# Altium project main_controller.PrjPcb
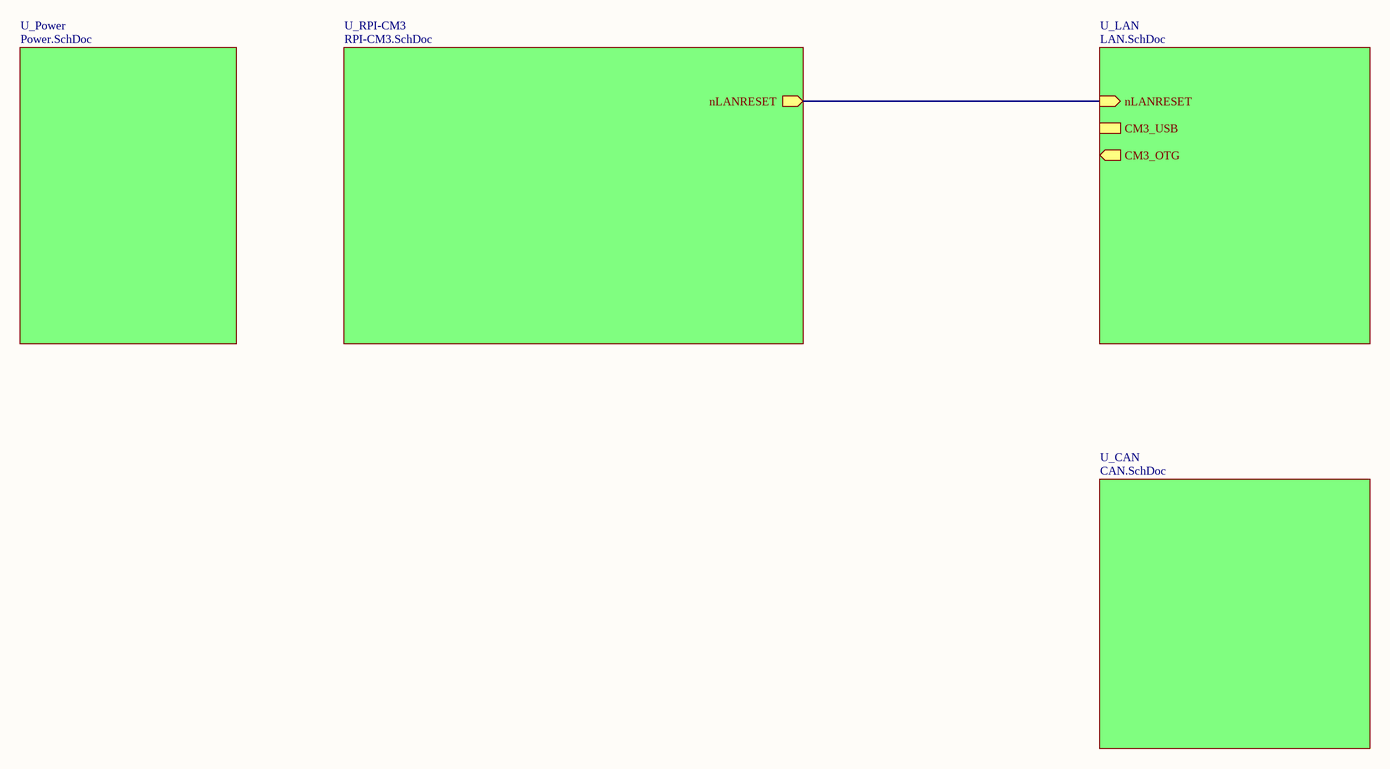
[diagram p0: TOP.SchDoc]
6 sheets, 243 parts. Net scope: hierarchical (ports join the sheet entries above them; power ports are global).
Sheets:
  TOP.SchDoc
    U_Power = Power.SchDoc
    U_RPI-CM3 = RPI-CM3.SchDoc
    U_LAN = LAN.SchDoc
      U_LAN-PWR = LAN-PWR.SchDoc
    U_CAN = CAN.SchDoc

## Sheet TOP.SchDoc
size A2

### Sub-sheets
U_CAN = CAN.SchDoc: no entries
U_LAN = LAN.SchDoc: nLANRESET (in), CM3_OTG (out), CM3_USB (harness CM3_USB)
U_Power = Power.SchDoc: no entries
U_RPI-CM3 = RPI-CM3.SchDoc: nLANRESET (out)

### Nets
NetA?#1_3: sheet U_RPI-CM3/nLANRESET, sheet U_LAN/nLANRESET

### Notes on the sheet
- Title
- Size:
- Date:
- A3
- Number:
- Time:
- Revision:
- Sheet
- of
- File:

## Sheet Power.SchDoc
size A2
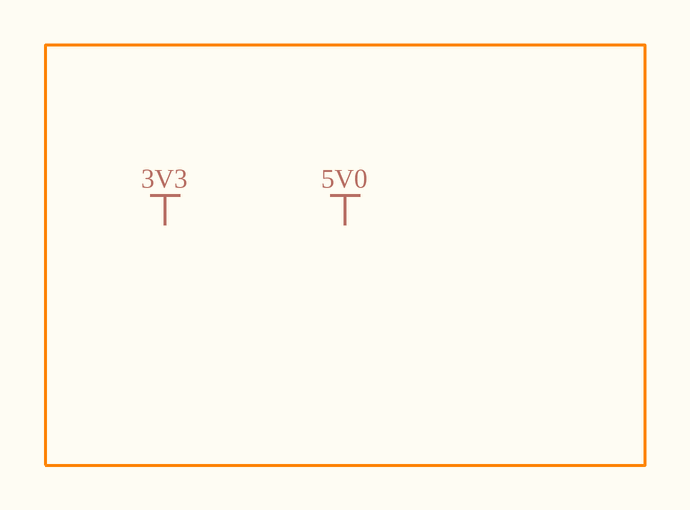
[diagram p1: Power.SchDoc]

### Notes on the sheet
- Labels drawn without touching a wire or pin: 3V3, 5V0
- Title
- Size:
- Date:
- A3
- Number:
- Time:
- Revision:
- Sheet
- of
- File:

## Sheet RPI-CM3.SchDoc
size A2
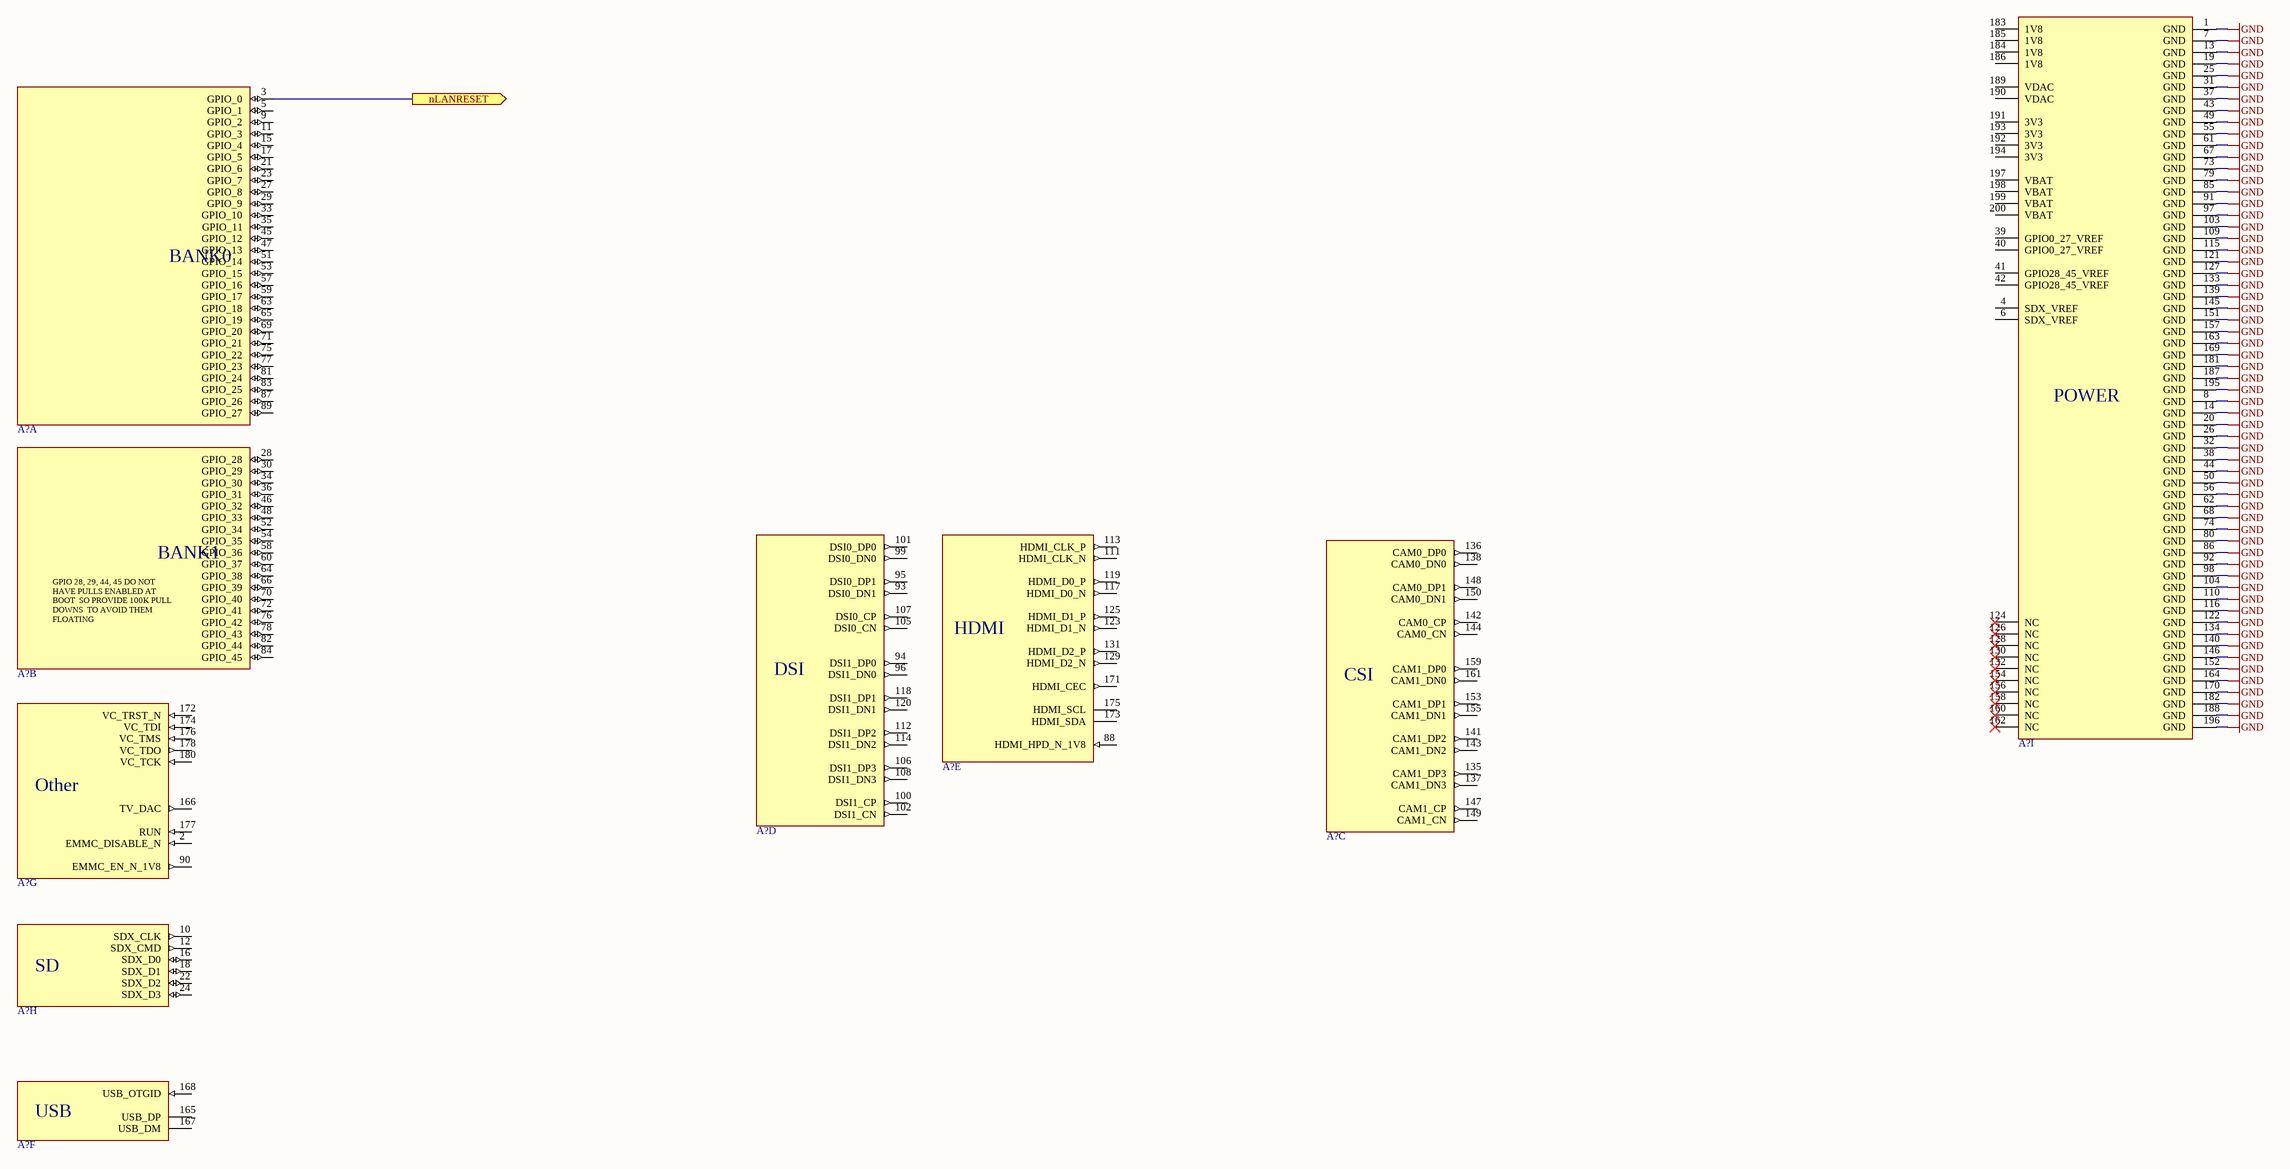
[diagram p2: RPI-CM3.SchDoc]

### Parts
(Parts that share a designator on the sheet are numbered #1, #2 ... from top to bottom, then left to right.)
A?#1  RPi-CM3  [SODIMM_TE_1717254-4_RPi_CM]  (value not drawn)  (part A of 9)
A?#2  RPi-CM3  [SODIMM_TE_1717254-4_RPi_CM]  (value not drawn)  (part B of 9)
A?#3  RPi-CM3  [SODIMM_TE_1717254-4_RPi_CM]  (value not drawn)  (part I of 9)
A?#4  RPi-CM3  [SODIMM_TE_1717254-4_RPi_CM]  (value not drawn)  (part E of 9)
A?#5  RPi-CM3  [SODIMM_TE_1717254-4_RPi_CM]  (value not drawn)  (part D of 9)
A?#6  RPi-CM3  [SODIMM_TE_1717254-4_RPi_CM]  (value not drawn)  (part C of 9)
A?#7  RPi-CM3  [SODIMM_TE_1717254-4_RPi_CM]  (value not drawn)  (part G of 9)
A?#8  RPi-CM3  [SODIMM_TE_1717254-4_RPi_CM]  (value not drawn)  (part H of 9)
A?#9  RPi-CM3  [SODIMM_TE_1717254-4_RPi_CM]  (value not drawn)  (part F of 9)

### Ports
nLANRESET (out)

### Nets
GND: A?#3.1(GND) A?#3.7(GND) A?#3.8(GND) A?#3.13(GND) A?#3.14(GND) A?#3.19(GND) A?#3.20(GND) A?#3.25(GND) A?#3.26(GND) A?#3.31(GND) A?#3.32(GND) A?#3.37(GND) A?#3.38(GND) A?#3.43(GND) A?#3.44(GND) A?#3.49(GND) A?#3.50(GND) A?#3.55(GND) A?#3.56(GND) A?#3.61(GND) A?#3.62(GND) A?#3.67(GND) A?#3.68(GND) A?#3.73(GND) A?#3.74(GND) A?#3.79(GND) A?#3.80(GND) A?#3.85(GND) A?#3.86(GND) A?#3.91(GND) A?#3.92(GND) A?#3.97(GND) A?#3.98(GND) A?#3.103(GND) A?#3.104(GND) A?#3.109(GND) A?#3.110(GND) A?#3.115(GND) A?#3.116(GND) A?#3.121(GND) A?#3.122(GND) A?#3.127(GND) A?#3.133(GND) A?#3.134(GND) A?#3.139(GND) A?#3.140(GND) A?#3.145(GND) A?#3.146(GND) A?#3.151(GND) A?#3.152(GND) A?#3.157(GND) A?#3.163(GND) A?#3.164(GND) A?#3.169(GND) A?#3.170(GND) A?#3.181(GND) A?#3.182(GND) A?#3.187(GND) A?#3.188(GND) A?#3.195(GND) A?#3.196(GND)
NetA?#1_3: A?#1.3(GPIO_0) ; port nLANRESET

Not connected (* = marked no-connect by the designer): A?#1 5(GPIO_1) 9(GPIO_2) 11(GPIO_3) 15(GPIO_4) 17(GPIO_5) 21(GPIO_6) 23(GPIO_7) 27(GPIO_8) 29(GPIO_9) 33(GPIO_10) 35(GPIO_11) 45(GPIO_12) 47(GPIO_13) 51(GPIO_14) 53(GPIO_15) 57(GPIO_16) 59(GPIO_17) 63(GPIO_18) 65(GPIO_19) 69(GPIO_20) 71(GPIO_21) 75(GPIO_22) 77(GPIO_23) 81(GPIO_24) 83(GPIO_25) 87(GPIO_26) 89(GPIO_27); A?#2 28(GPIO_28) 30(GPIO_29) 34(GPIO_30) 36(GPIO_31) 46(GPIO_32) 48(GPIO_33) 52(GPIO_34) 54(GPIO_35) 58(GPIO_36) 60(GPIO_37) 64(GPIO_38) 66(GPIO_39) 70(GPIO_40) 72(GPIO_41) 76(GPIO_42) 78(GPIO_43) 82(GPIO_44) 84(GPIO_45); A?#3 4(SDX_VREF) 6(SDX_VREF) 39(GPIO0_27_VREF) 40(GPIO0_27_VREF) 41(GPIO28_45_VREF) 42(GPIO28_45_VREF) 124(NC)* 126(NC)* 128(NC)* 130(NC)* 132(NC)* 154(NC)* 156(NC)* 158(NC)* 160(NC)* 162(NC)* 183(1V8) 184(1V8) 185(1V8) 186(1V8) 189(VDAC) 190(VDAC) 191(3V3) 192(3V3) 193(3V3) 194(3V3) 197(VBAT) 198(VBAT) 199(VBAT) 200(VBAT); A?#4 88(HDMI_HPD_N_1V8) 111(HDMI_CLK_N) 113(HDMI_CLK_P) 117(HDMI_D0_N) 119(HDMI_D0_P) 123(HDMI_D1_N) 125(HDMI_D1_P) 129(HDMI_D2_N) 131(HDMI_D2_P) 171(HDMI_CEC) 173(HDMI_SDA) 175(HDMI_SCL); A?#5 93(DSI0_DN1) 94(DSI1_DP0) 95(DSI0_DP1) 96(DSI1_DN0) 99(DSI0_DN0) 100(DSI1_CP) 101(DSI0_DP0) 102(DSI1_CN) 105(DSI0_CN) 106(DSI1_DP3) 107(DSI0_CP) 108(DSI1_DN3) 112(DSI1_DP2) 114(DSI1_DN2) 118(DSI1_DP1) 120(DSI1_DN1); A?#6 135(CAM1_DP3) 136(CAM0_DP0) 137(CAM1_DN3) 138(CAM0_DN0) 141(CAM1_DP2) 142(CAM0_CP) 143(CAM1_DN2) 144(CAM0_CN) 147(CAM1_CP) 148(CAM0_DP1) 149(CAM1_CN) 150(CAM0_DN1) 153(CAM1_DP1) 155(CAM1_DN1) 159(CAM1_DP0) 161(CAM1_DN0); A?#7 2(EMMC_DISABLE_N) 90(EMMC_EN_N_1V8) 166(TV_DAC) 172(VC_TRST_N) 174(VC_TDI) 176(VC_TMS) 177(RUN) 178(VC_TDO) 180(VC_TCK); A?#8 10(SDX_CLK) 12(SDX_CMD) 16(SDX_D0) 18(SDX_D1) 22(SDX_D2) 24(SDX_D3); A?#9 165(USB_DP) 167(USB_DM) 168(USB_OTGID)

### Notes on the sheet
- Title
- Size:
- Date:
- A3
- Number:
- Time:
- Revision:
- Sheet
- of
- File:
- (in symbol 040107-0001, part A) BANK0
- (in symbol 040107-0001, part B) BANK1; GPIO 28, 29, 44, 45 DO NOT  HAVE PULLS ENABLED AT BOOT  SO PROVIDE 100K PULL DOWNS  TO AVOID THEM FLOATING
- (in symbol 040107-0001, part C) CSI
- (in symbol 040107-0001, part D) DSI
- (in symbol 040107-0001, part E) HDMI
- (in symbol 040107-0001, part F) USB
- (in symbol 040107-0001, part G) Other
- (in symbol 040107-0001, part H) SD
- (in symbol 040107-0001, part I) POWER

### Library data of the parts
A?#1-A?#9 = 040107-0001: I# SOM RaspberryPi Compute Module 3 RPi-CM3; TempRange: -25/80°C; PartNumber: 040107-0001; Value: RPi-CM3; Info: RaspberryPi Compute Module 3

## Sheet LAN.SchDoc
size A2
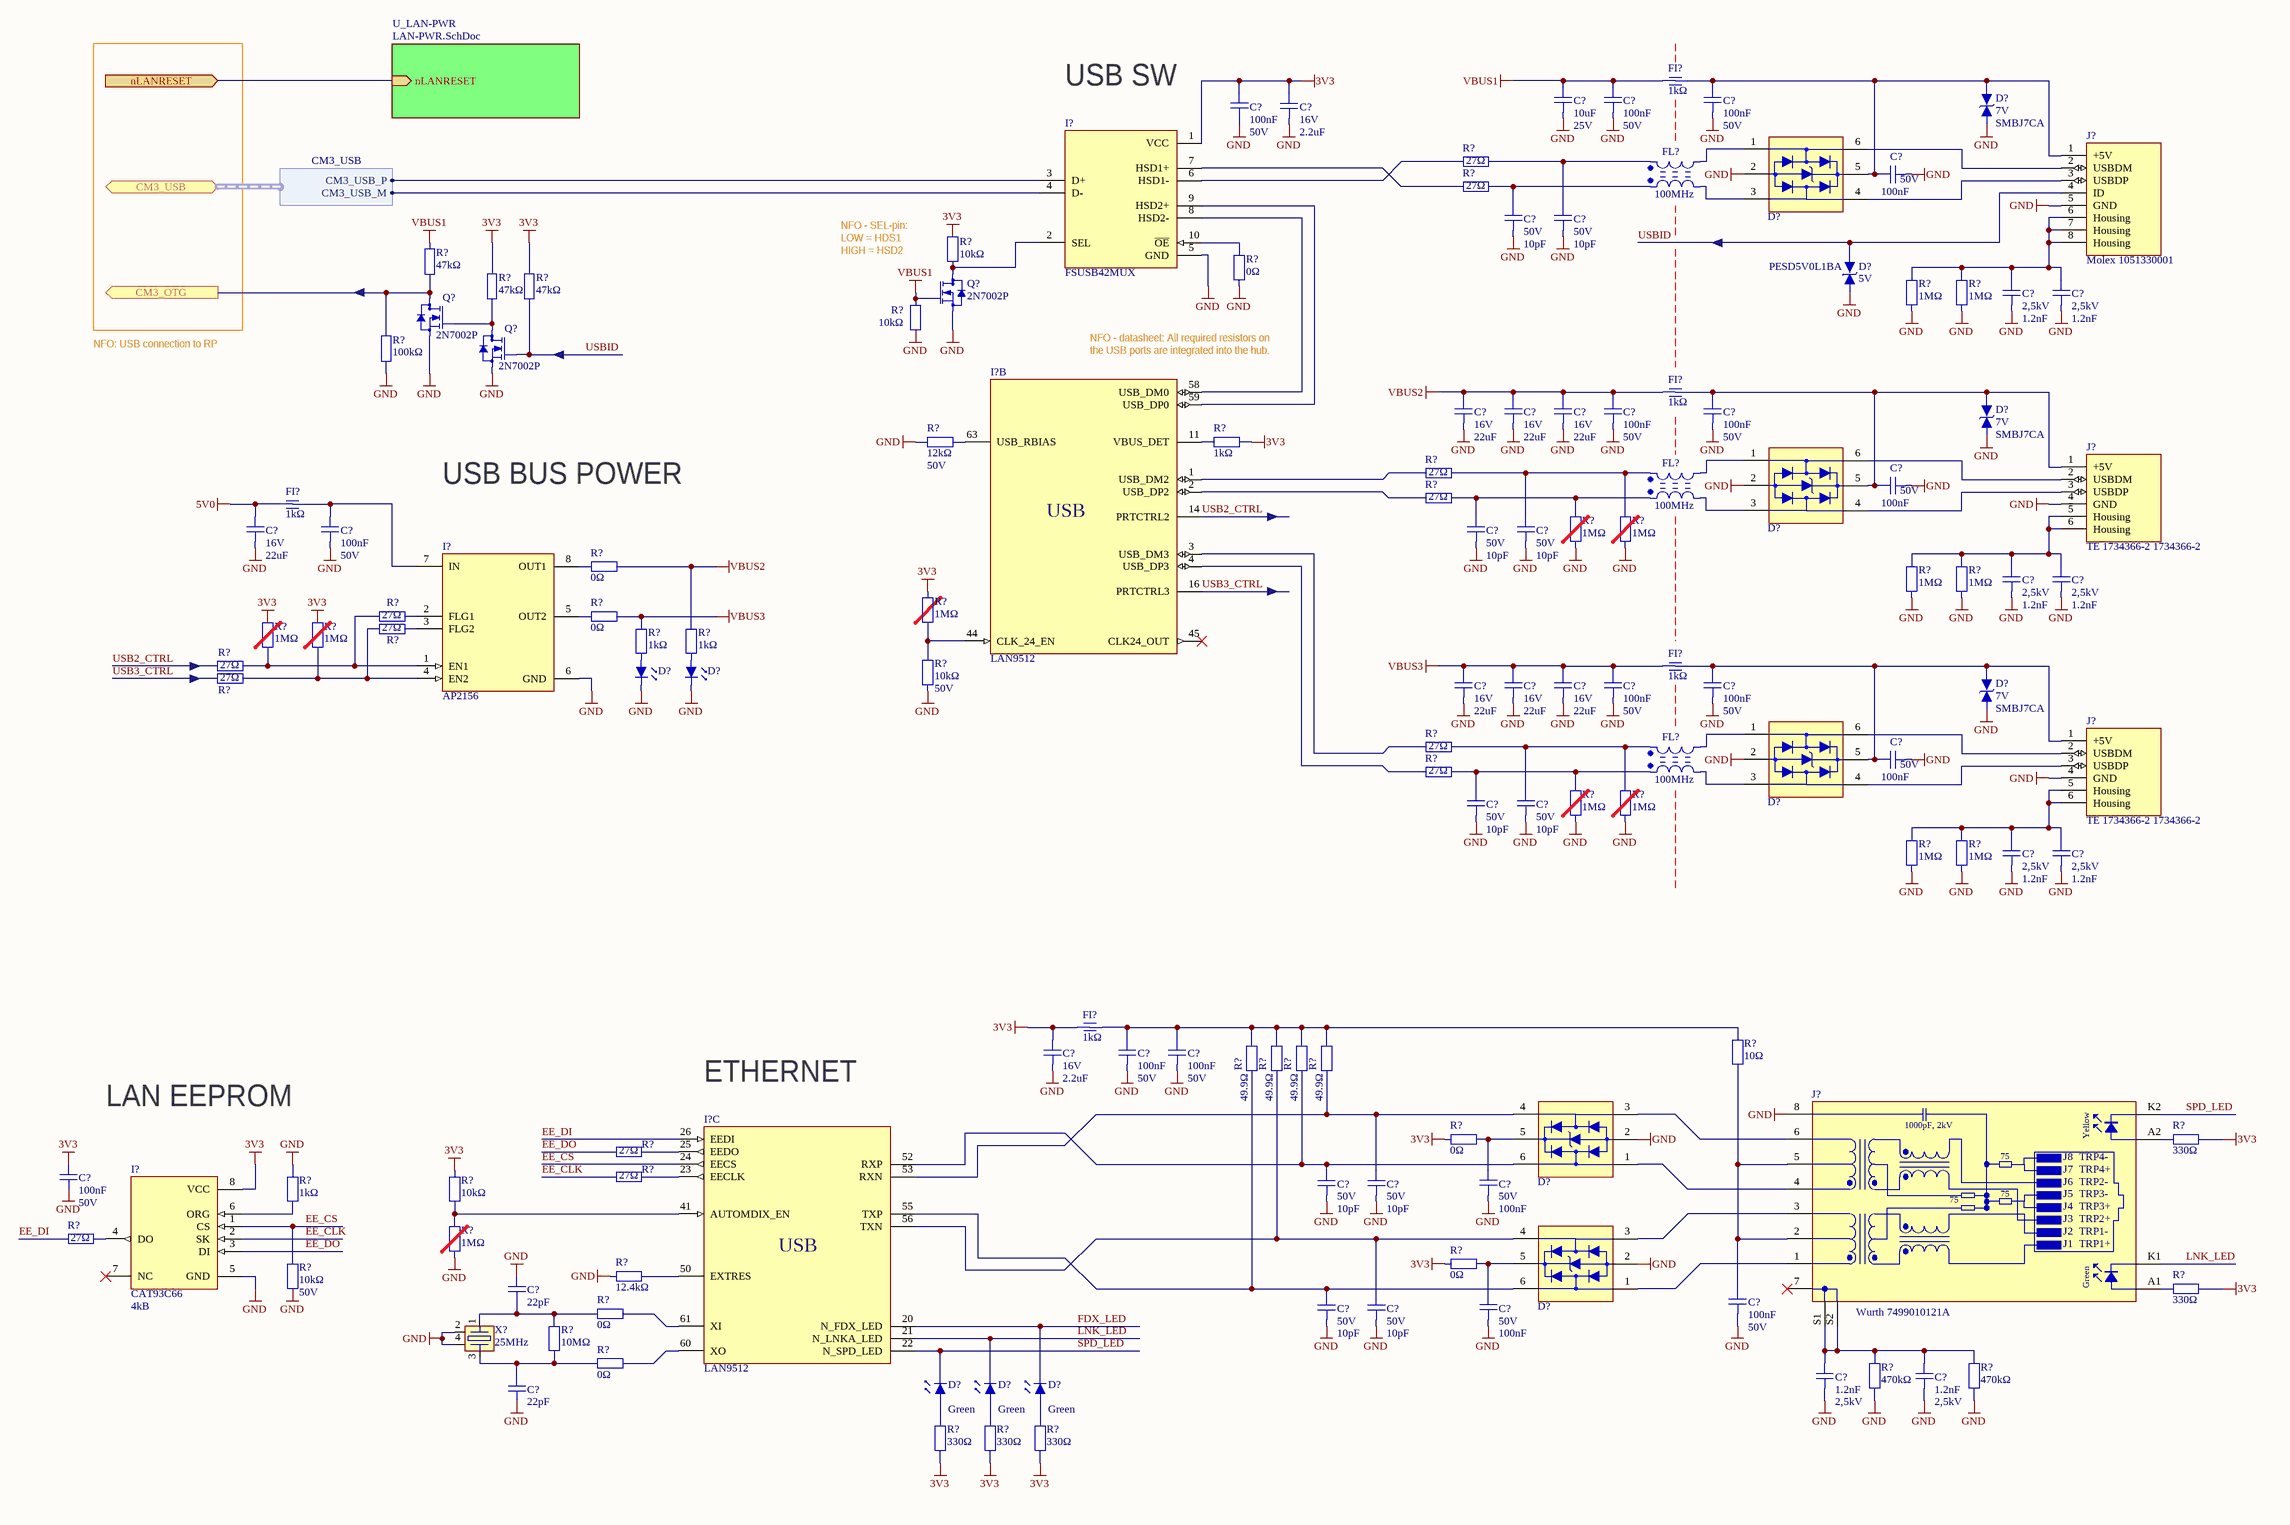
[diagram p3: LAN.SchDoc]

### Parts
(Parts that share a designator on the sheet are numbered #1, #2 ... from top to bottom, then left to right.)
C?#1  Voltage: 25V  [C0603M_1709282117]  (hidden comment: 10uF)
C?#2  Voltage: 50V  [C0603M_1709282117]  (hidden comment: 100nF)
C?#3  Voltage: 50V  [C0603M_1709282117]  (hidden comment: 100nF)
C?#4  Voltage: 50V  [C0603M_1709282117]  (hidden comment: 100nF)
C?#5  Value2: 16V  [C0603M_1709282117]  (hidden comment: 2.2uF)
C?#6  Value2: 50V  [C0402M_CAPC1005X06N]  (hidden comment: 100nF)
C?#7  Value2: 50V  [C0603M_1709282117]  (hidden comment: 10pF)
C?#8  Value2: 50V  [C0603M_1709282117]  (hidden comment: 10pF)
C?#9  Value2: 2,5kV  [C1808M_1709112222]  (hidden comment: 1.2nF)
C?#10  Value2: 2,5kV  [C1808M_1709112222]  (hidden comment: 1.2nF)
C?#11  Value2: 16V  [C0805M_1708282121]  (hidden comment: 22uF)
C?#12  Value2: 16V  [C0805M_1708282121]  (hidden comment: 22uF)
C?#13  Value2: 16V  [C0805M_1708282121]  (hidden comment: 22uF)
C?#14  Voltage: 50V  [C0603M_1709282117]  (hidden comment: 100nF)
C?#15  Voltage: 50V  [C0603M_1709282117]  (hidden comment: 100nF)
C?#16  Value2: 50V  [C0402M_CAPC1005X06N]  (hidden comment: 100nF)
C?#17  Value2: 16V  [C0805M_1708282121]  (hidden comment: 22uF)
C?#18  Voltage: 50V  [C0603M_1709282117]  (hidden comment: 100nF)
C?#19  Value2: 50V  [C0603M_1709282117]  (hidden comment: 10pF)
C?#20  Value2: 50V  [C0603M_1709282117]  (hidden comment: 10pF)
C?#21  Value2: 2,5kV  [C1808M_1709112222]  (hidden comment: 1.2nF)
C?#22  Value2: 2,5kV  [C1808M_1709112222]  (hidden comment: 1.2nF)
C?#23  Value2: 16V  [C0805M_1708282121]  (hidden comment: 22uF)
C?#24  Value2: 16V  [C0805M_1708282121]  (hidden comment: 22uF)
C?#25  Value2: 16V  [C0805M_1708282121]  (hidden comment: 22uF)
C?#26  Voltage: 50V  [C0603M_1709282117]  (hidden comment: 100nF)
C?#27  Voltage: 50V  [C0603M_1709282117]  (hidden comment: 100nF)
C?#28  Value2: 50V  [C0402M_CAPC1005X06N]  (hidden comment: 100nF)
C?#29  Value2: 50V  [C0603M_1709282117]  (hidden comment: 10pF)
C?#30  Value2: 50V  [C0603M_1709282117]  (hidden comment: 10pF)
C?#31  Value2: 2,5kV  [C1808M_1709112222]  (hidden comment: 1.2nF)
C?#32  Value2: 2,5kV  [C1808M_1709112222]  (hidden comment: 1.2nF)
C?#33  Value2: 16V  [C0603M_1709282117]  (hidden comment: 2.2uF)
C?#34  Voltage: 50V  [C0603M_1709282117]  (hidden comment: 100nF)
C?#35  Voltage: 50V  [C0603M_1709282117]  (hidden comment: 100nF)
C?#36  Voltage: 50V  [C0603M_1709282117]  (hidden comment: 100nF)
C?#37  Value2: 50V  [C0603M_1709282117]  (hidden comment: 10pF)
C?#38  Value2: 50V  [C0603M_1709282117]  (hidden comment: 10pF)
C?#39  Value2: 50V  [C0402M_CAPC1005X06N]  (hidden comment: 100nF)
C?#40  22pF  [C0603M_1709282117]
C?#41  Voltage: 50V  [C0603M_1709282117]  (hidden comment: 100nF)
C?#42  Value2: 50V  [C0603M_1709282117]  (hidden comment: 10pF)
C?#43  Value2: 50V  [C0603M_1709282117]  (hidden comment: 10pF)
C?#44  Value2: 50V  [C0402M_CAPC1005X06N]  (hidden comment: 100nF)
C?#45  Voltage: 2,5kV  [C1808M_1709112222]  (hidden comment: 1.2nF)
C?#46  Voltage: 2,5kV  [C1808M_1709112222]  (hidden comment: 1.2nF)
C?#47  22pF  [C0603M_1709282117]
D?#1  Value2: SMBJ7CA  [SMB_1709102243]  (hidden comment: 7V)
D?#2  USBLC6-2  [SOT23-6_1709062233]  (value not drawn)
D?#3  Value2: PESD5V0L1BA  [SOD-323_1706282215]  (hidden comment: 5V)
D?#4  Value2: SMBJ7CA  [SMB_1709102243]  (hidden comment: 7V)
D?#5  USBLC6-2  [SOT23-6_1709062233]  (value not drawn)
D?#6  SML-D12P8WT86C  [LED_SML-D12x8_1709122228]  (value not drawn)
D?#7  SML-D12P8WT86C  [LED_SML-D12x8_1709122228]  (value not drawn)
D?#8  Value2: SMBJ7CA  [SMB_1709102243]  (hidden comment: 7V)
D?#9  USBLC6-2  [SOT23-6_1709062233]  (value not drawn)
D?#10  USBLC6-2  [SOT23-6_1709062233]  (value not drawn)
D?#11  USBLC6-2  [SOT23-6_1709062233]  (value not drawn)
D?#12  Color: Green  [LED_SML-D12x8_1709122228]  (hidden comment: SML-D12P8WT86C)
D?#13  Color: Green  [LED_SML-D12x8_1709122228]  (hidden comment: SML-D12P8WT86C)
D?#14  Color: Green  [LED_SML-D12x8_1709122228]  (hidden comment: SML-D12P8WT86C)
FI?#1  1kΩ  [L0805M_1708232324]
FI?#2  1kΩ  [L0805M_1708232324]
FI?#3  1kΩ  [L0805M_1708232324]
FI?#4  1kΩ  [L0805M_1708232324]
FI?#5  1kΩ  [L0805M_1708232324]
FL?#1  Value2: 100MHz  [CM0805M_1709062254]  (hidden comment: 90Ω)
FL?#2  Value2: 100MHz  [CM0805M_1709062254]  (hidden comment: 90Ω)
FL?#3  Value2: 100MHz  [CM0805M_1709062254]  (hidden comment: 90Ω)
I?#1  FSUSB42MUX  [MSOP10_1709052053]
I?#2  LAN9512  [QFN64_1706282152]  (part B of 3)
I?#3  AP2156  [MSOP8_EP_1709052156]
I?#4  Size: 4kB  [TSSOP8_1709172348]  (hidden comment: CAT93C66)
I?#5  LAN9512  [QFN64_1706282152]  (part C of 3)
J?#1  Article: Molex 1051330001  [USB_A_MOLEX_1051330001_1709052340]
J?#2  Article: TE 1734366-2 / 1734366-2  [USB_A_TE_1734366-2_1709052230]
J?#3  Article: TE 1734366-2 / 1734366-2  [USB_A_TE_1734366-2_1709052230]
J?#4  Article: Wurth 7499010121A  [RJ45_WE_7499010121A]
Q?#1  2N7002P  [SOT23_1709070018]
Q?#2  2N7002P  [SOT23_1709070018]
Q?#3  2N7002P  [SOT23_1709070018]
R?#1  27Ω  [R0603M_RESC1608X06N]
R?#2  27Ω  [R0603M_RESC1608X06N]
R?#3  10kΩ  [R0603M_RESC1608X06N]
R?#4  47kΩ  [R0603M_RESC1608X06N]
R?#5  0Ω  [R0603M_RESC1608X06N]
R?#6  47kΩ  [R0603M_RESC1608X06N]
R?#7  47kΩ  [R0603M_RESC1608X06N]
R?#8  1MΩ  [R0603M_RESC1608X06N]
R?#9  1MΩ  [R0603M_RESC1608X06N]
R?#10  10kΩ  [R0603M_RESC1608X06N]
R?#11  100kΩ  [R0603M_RESC1608X06N]
R?#12  Voltage: 50V  [R0603M_RESC1608X06N]  (hidden comment: 12kΩ)
R?#13  1kΩ  [R0603M_RESC1608X06N]
R?#14  27Ω  [R0603M_RESC1608X06N]
R?#15  27Ω  [R0603M_RESC1608X06N]
R?#16  1MΩ  [R0603M_RESC1608X06N]
R?#17  1MΩ  [R0603M_RESC1608X06N]
R?#18  0Ω  [R0805M_RESC2012X06N]
R?#19  1MΩ  [R0603M_RESC1608X06N]
R?#20  1MΩ  [R0603M_RESC1608X06N]
R?#21  1MΩ  [R0603M_RESC1608X06N]
R?#22  27Ω  [R0603M_RESC1608X06N]
R?#23  0Ω  [R0805M_RESC2012X06N]
R?#24  27Ω  [R0603M_RESC1608X06N]
R?#25  1MΩ  [R0603M_RESC1608X06N]
R?#26  1MΩ  [R0603M_RESC1608X06N]
R?#27  1kΩ  [R0603M_RESC1608X06N]
R?#28  1kΩ  [R0603M_RESC1608X06N]
R?#29  27Ω  [R0603M_RESC1608X06N]
R?#30  Voltage: 50V  [R0603M_RESC1608X06N]  (hidden comment: 10kΩ)
R?#31  27Ω  [R0603M_RESC1608X06N]
R?#32  27Ω  [R0603M_RESC1608X06N]
R?#33  27Ω  [R0603M_RESC1608X06N]
R?#34  1MΩ  [R0603M_RESC1608X06N]
R?#35  1MΩ  [R0603M_RESC1608X06N]
R?#36  1MΩ  [R0603M_RESC1608X06N]
R?#37  1MΩ  [R0603M_RESC1608X06N]
R?#38  10Ω  [R0603M_RESC1608X06N]
R?#39  49.9Ω  [R0603M_RESC1608X06N]
R?#40  49.9Ω  [R0603M_RESC1608X06N]
R?#41  49.9Ω  [R0603M_RESC1608X06N]
R?#42  49.9Ω  [R0603M_RESC1608X06N]
R?#43  0Ω  [R0603M_RESC1608X06N]
R?#44  330Ω  [R0603M_RESC1608X06N]
R?#45  27Ω  [R0603M_RESC1608X06N]
R?#46  27Ω  [R0603M_RESC1608X06N]
R?#47  1kΩ  [R0603M_RESC1608X06N]
R?#48  10kΩ  [R0603M_RESC1608X06N]
R?#49  27Ω  [R0603M_RESC1608X06N]
R?#50  1MΩ  [R0603M_RESC1608X06N]
R?#51  0Ω  [R0603M_RESC1608X06N]
R?#52  Voltage: 50V  [R0603M_RESC1608X06N]  (hidden comment: 10kΩ)
R?#53  12.4kΩ  [R0603M_RESC1608X06N]
R?#54  330Ω  [R0603M_RESC1608X06N]
R?#55  0Ω  [R0603M_RESC1608X06N]
R?#56  10MΩ  [R0603M_RESC1608X06N]
R?#57  0Ω  [R0603M_RESC1608X06N]
R?#58  470kΩ  [R1206M_RESC3216X06N]
R?#59  470kΩ  [R1206M_RESC3216X06N]
R?#60  330Ω  [R0603M_RESC1608X06N]
R?#61  330Ω  [R0603M_RESC1608X06N]
R?#62  330Ω  [R0603M_RESC1608X06N]
X?#1  Frequency: 25MHz  [crystal_4p_5x3.2_1709212345]

### Sub-sheets
U_LAN-PWR = LAN-PWR.SchDoc: nLANRESET (in)

### Ports
CM3_OTG (out), CM3_USB (harness CM3_USB), nLANRESET (in)

### Harnesses
CM3_USB: CM3_USB_P, CM3_USB_M

### Nets
3V3: C?#4.1 C?#5.2 C?#33.2 C?#36.2 FI?#5.2 I?#1.1(VCC) I?#4.8(VCC) R?#3.2 R?#6.2 R?#7.2 R?#13.2 R?#21.2 R?#25.2 R?#26.2 R?#43.1 R?#44.2 R?#48.2 R?#51.1 R?#54.2 R?#60.1 R?#61.1 R?#62.1
5V0: C?#17.2 FI?#3.1
GND: C?#1.1 C?#2.1 C?#3.1 C?#4.2 C?#5.1 C?#6.1 C?#7.1 C?#8.1 C?#9.1 C?#10.1 C?#11.1 C?#12.1 C?#13.1 C?#14.1 C?#15.1 C?#16.1 C?#17.1 C?#18.1 C?#19.1 C?#20.1 C?#21.1 C?#22.1 C?#23.1 C?#24.1 C?#25.1 C?#26.1 C?#27.1 C?#28.1 C?#29.1 C?#30.1 C?#31.1 C?#32.1 C?#33.1 C?#34.1 C?#35.1 C?#36.1 C?#37.1 C?#38.1 C?#39.2 C?#40.2 C?#41.1 C?#42.1 C?#43.1 C?#44.2 C?#45.1 C?#46.1 C?#47.1 D?#1.1(Anode) D?#2.2 D?#3.1(Anode) D?#4.1(Anode) D?#5.2 D?#6.1(Cathode) D?#7.1(Cathode) D?#8.1(Anode) D?#9.2 D?#10.2 D?#11.2 I?#1.5(GND) I?#3.6(GND) I?#4.5(GND) J?#1.5(GND) J?#2.4(GND) J?#3.4(GND) J?#4.8(GND) Q?#1.3(D) Q?#2.3(D) Q?#3.3(D) R?#5.1 R?#8.1 R?#9.1 R?#10.1 R?#11.1 R?#12.1 R?#16.1 R?#17.1 R?#19.1 R?#20.1 R?#30.1 R?#34.1 R?#35.1 R?#36.1 R?#37.1 R?#47.1 R?#50.1 R?#52.1 R?#53.1 R?#58.1 R?#59.1 X?#1.2 X?#1.4
VBUS1: C?#1.2 C?#2.2 FI?#1.1 Q?#1.1(G) R?#4.2 R?#10.2
VBUS2: C?#11.2 C?#12.2 C?#13.2 C?#14.2 FI?#2.1 R?#18.2 R?#28.2
VBUS3: C?#23.2 C?#24.2 C?#25.2 C?#26.2 FI?#4.1 R?#23.2 R?#27.2
EE_CLK: I?#4.2(SK) R?#46.1
EE_CS: I?#4.1(CS) I?#5.24(EECS) R?#52.2
EE_DI: I?#5.26(EEDI) R?#49.1
EE_DO: I?#4.3(DI) R?#45.1
FDX_LED: D?#14.1(Cathode) I?#5.20(N_FDX_LED)
LNK_LED: D?#13.1(Cathode) I?#5.21(N_LNKA_LED) J?#4.K1(LED1_K)
SPD_LED: D?#12.1(Cathode) I?#5.22(N_SPD_LED) J?#4.K2(LED2_K)
USB2_CTRL: I?#2.14(PRTCTRL2) R?#29.1
USB3_CTRL: I?#2.16(PRTCTRL3) R?#31.1
USBID: D?#3.2(Cathode) J?#1.4(ID) Q?#3.1(G) R?#7.1
NetA?#1_3: port nLANRESET, sheet U_LAN-PWR/nLANRESET
NetC?#3_2: C?#3.2 C?#6.2 D?#1.2(Cathode) D?#2.5 FI?#1.2 J?#1.1(+5V)
NetC?#7_2: C?#7.2 FL?#1.4 R?#2.2
NetC?#8_2: C?#8.2 FL?#1.1 R?#1.2
NetC?#9_2: C?#9.2 C?#10.2 J?#1.6(Housing) J?#1.7(Housing) J?#1.8(Housing) R?#8.2 R?#9.2
NetC?#15_2: C?#15.2 C?#16.2 D?#4.2(Cathode) D?#5.5 FI?#2.2 J?#2.1(+5V)
NetC?#18_2: C?#18.2 FI?#3.2 I?#3.7(IN)
NetC?#19_2: C?#19.2 FL?#2.4 R?#15.2 R?#16.2
NetC?#20_2: C?#20.2 FL?#2.1 R?#14.2 R?#17.2
NetC?#21_2: C?#21.2 C?#22.2 J?#2.5(Housing) J?#2.6(Housing) R?#19.2 R?#20.2
NetC?#27_2: C?#27.2 C?#28.2 D?#8.2(Cathode) D?#9.5 FI?#4.2 J?#3.1(+5V)
NetC?#29_2: C?#29.2 FL?#3.4 R?#33.2 R?#34.2
NetC?#30_2: C?#30.2 FL?#3.1 R?#32.2 R?#35.2
NetC?#31_2: C?#31.2 C?#32.2 J?#3.5(Housing) J?#3.6(Housing) R?#36.2 R?#37.2
NetC?#34_2: C?#34.2 C?#35.2 FI?#5.1 R?#38.2 R?#39.2 R?#40.2 R?#41.2 R?#42.2
NetC?#37_2: C?#37.2 D?#10.6 I?#5.52(RXP) R?#41.1
NetC?#38_2: C?#38.2 D?#10.4 I?#5.53(RXN) R?#42.1
NetC?#39_1: C?#39.1 D?#10.5 R?#43.2
NetC?#40_1: C?#40.1 R?#55.1 R?#56.2 X?#1.1
NetC?#41_2: C?#41.2 J?#4.2(TRCT1) J?#4.5(TRCT2) R?#38.1
NetC?#42_2: C?#42.2 D?#11.6 I?#5.55(TXP) R?#39.1
NetC?#43_2: C?#43.2 D?#11.4 I?#5.56(TXN) R?#40.1
NetC?#44_1: C?#44.1 D?#11.5 R?#51.2
NetC?#45_2: C?#45.2 C?#46.2 J?#4.S1(Shield) J?#4.S2(Shield) R?#58.2 R?#59.2
NetC?#47_2: C?#47.2 R?#56.1 R?#57.1 X?#1.3
NetD?#2_1: D?#2.1 FL?#1.2
NetD?#2_3: D?#2.3 FL?#1.3
NetD?#2_4: D?#2.4 J?#1.3(USBDP)
NetD?#2_6: D?#2.6 J?#1.2(USBDM)
NetD?#5_1: D?#5.1 FL?#2.2
NetD?#5_3: D?#5.3 FL?#2.3
NetD?#5_4: D?#5.4 J?#2.3(USBDP)
NetD?#5_6: D?#5.6 J?#2.2(USBDM)
NetD?#6_2: D?#6.2(Anode) R?#27.1
NetD?#7_2: D?#7.2(Anode) R?#28.1
NetD?#9_1: D?#9.1 FL?#3.2
NetD?#9_3: D?#9.3 FL?#3.3
NetD?#9_4: D?#9.4 J?#3.3(USBDP)
NetD?#9_6: D?#9.6 J?#3.2(USBDM)
NetD?#10_1: D?#10.1 J?#4.4(TRD2+)
NetD?#10_3: D?#10.3 J?#4.6(TRD2-)
NetD?#11_1: D?#11.1 J?#4.1(TRD1+)
NetD?#11_3: D?#11.3 J?#4.3(TRD1-)
NetD?#12_2: D?#12.2(Anode) R?#60.2
NetD?#13_2: D?#13.2(Anode) R?#61.2
NetD?#14_2: D?#14.2(Anode) R?#62.2
NetI?#1_2: I?#1.2(SEL) Q?#1.2(S) R?#3.1
NetI?#1_3: I?#1.3(D+) ; port CM3_USB.CM3_USB_P
NetI?#1_4: I?#1.4(D-) ; port CM3_USB.CM3_USB_M
NetI?#1_6: I?#1.6(HSD1-) R?#1.1
NetI?#1_7: I?#1.7(HSD1+) R?#2.1
NetI?#1_8: I?#1.8(HSD2-) I?#2.58(USB_DM0)
NetI?#1_9: I?#1.9(HSD2+) I?#2.59(USB_DP0)
NetI?#1_10: I?#1.10(~{OE}) R?#5.2
NetI?#2_1: I?#2.1(USB_DM2) R?#14.1
NetI?#2_2: I?#2.2(USB_DP2) R?#15.1
NetI?#2_3: I?#2.3(USB_DM3) R?#32.1
NetI?#2_4: I?#2.4(USB_DP3) R?#33.1
NetI?#2_11: I?#2.11(VBUS_DET) R?#13.1
NetI?#2_44: I?#2.44(CLK_24_EN) R?#21.1 R?#30.2
NetI?#2_63: I?#2.63(USB_RBIAS) R?#12.2
NetI?#3_1: I?#3.1(EN1) R?#22.1 R?#25.1 R?#29.2
NetI?#3_2: I?#3.2(FLG1) R?#22.2
NetI?#3_3: I?#3.3(FLG2) R?#24.2
NetI?#3_4: I?#3.4(EN2) R?#24.1 R?#26.1 R?#31.2
NetI?#3_5: I?#3.5(OUT2) R?#23.1
NetI?#3_8: I?#3.8(OUT1) R?#18.1
NetI?#4_4: I?#4.4(DO) R?#49.2
NetI?#4_6: I?#4.6(ORG) R?#47.2
NetI?#5_23: I?#5.23(EECLK) R?#46.2
NetI?#5_25: I?#5.25(EEDO) R?#45.2
NetI?#5_41: I?#5.41(AUTOMDIX_EN) R?#48.1 R?#50.2
NetI?#5_50: I?#5.50(EXTRES) R?#53.2
NetI?#5_60: I?#5.60(XO) R?#57.2
NetI?#5_61: I?#5.61(XI) R?#55.2
NetJ?#4_A1: J?#4.A1(LED1_A) R?#54.1
NetJ?#4_A2: J?#4.A2(LED2_A) R?#44.1
NetQ?#2_1: Q?#2.1(G) Q?#3.2(S) R?#6.1
NetQ?#2_2: Q?#2.2(S) R?#4.1 R?#11.2 ; port CM3_OTG

Not connected (* = marked no-connect by the designer): I?#2 45(CLK24_OUT)*; I?#4 7(NC)*; J?#4 7(Shield)*

### Notes on the sheet
- USB SW
- NFO - SEL-pin:
  LOW = HDS1
  HIGH = HSD2
- NFO: USB connection to RP
- (near I?#2) NFO - datasheet: All required resistors on the USB ports are integrated into the hub.
- USB BUS POWER
- LAN EEPROM
- (near I?#5) ETHERNET
- Title
- Size:
- Date:
- A3
- Number:
- Time:
- Revision:
- Sheet
- of
- File:
- (in symbol 040703-0001, part B) USB
- (in symbol 040703-0001, part C) USB
- (in symbol 070502-0001) 1000pF, 2kV; Yellow; 75; J8; TRP4-; J7; TRP4+; J6; TRP2-; J5; TRP3-; J4; TRP3+; J3; TRP2+; J2; TRP1-; J1; TRP1+; Green

### Library data of the parts
C?#1 = 010103-0083: C# CER  10uF 20% 25V X5R 0603; TempRange: -55/85°C; PartNumber: 010103-0083; Value: 10uF; Tolerance: 20%; Package: 0603; Dielectric: X5R; Type: CER
C?#2-C?#4 C?#14 C?#15 C?#18 C?#26 C?#27 C?#34-C?#36 C?#41 = 010103-0061: C# CER  100nF 10% 50V X7R 0603; TempRange: -55/125°C; PartNumber: 010103-0061; Value: 100nF; Tolerance: 10%; Package: 0603; Dielectric: X7R; Type: CER
C?#5 C?#33 = 010103-0074: C# CER  2.2uF 20% 16V X7R 0603; TempRange: -55/125°C; PartNumber: 010103-0074; Value: 2.2uF; Voltage: 16V; Tolerance: 20%; Package: 0603; Dielectric: X7R; Type: CER
C?#6 C?#16 C?#28 C?#39 C?#44 = 010103-0025: C# CER  100nF 10% 50V X7R 0402; TempRange: -55/125°C; PartNumber: 010103-0025; Value: 100nF; Voltage: 50V; Tolerance: 10%; Package: 0402; Dielectric: X7R; Type: CER
C?#7 C?#8 C?#19 C?#20 C?#29 C?#30 C?#37 C?#38 C?#42 C?#43 = 010103-0125: C# CER  10pF 5% 50V NP0 0603; TempRange: -55/125°C; PartNumber: 010103-0125; Value: 10pF; Voltage: 50V; Tolerance: 5%; Package: 0603; Dielectric: NP0; Type: CER
C?#9 C?#10 C?#21 C?#22 C?#31 C?#32 C?#45 C?#46 = 010103-0151: C# CER  1.2nF 10% 2,5kV X7R 1808; TempRange: -55/125°C; PartNumber: 010103-0151; Value: 1.2nF; Tolerance: 10%; Package: 1808; Dielectric: X7R; Type: CER
  C?#9 C?#10 C?#21 C?#22 C?#31 C?#32: Voltage: 2,5kV
C?#11-C?#13 C?#17 C?#23-C?#25 = 010103-0102: C# CER  22uF 10% 16V X5R 0805; TempRange: -55/85°C; PartNumber: 010103-0102; Value: 22uF; Voltage: 16V; Tolerance: 10%; Package: 0805; Dielectric: X5R; Type: CER
C?#40 C?#47 = 010103-0129: C# CER  22pF 5% 50V NP0 0603; TempRange: -55/125°C; PartNumber: 010103-0129; Value: 22pF; Voltage: 50V; Tolerance: 5%; Package: 0603; Dielectric: NP0; Type: CER
D?#1 D?#4 D?#8 = 090201-0009: D# TVS BI 7V  7V 600W -55/150°C SMB; VoltageBreakMin: 7,78V; VoltageBreakMax: 8,6V; VoltageClamp: 12V; PartNumber: 090201-0009; Value: 7V; VoltageStandoff: 7V; Polarity: BI; Power: 600W; Package: SMB; TempRange: -55/150°C; Type: TVS
D?#2 D?#5 D?#9-D?#11 = 090201-0001: D# TVS USBLC6-2 USB2.0 -40/125°C SOT23-6; PartNumber: 090201-0001; Value: USBLC6-2; Info: USB2.0; Package: SOT23-6; TempRange: -40/125°C; Type: TVS
D?#3 = 090201-0003: D# TVS BI 5V  5V 500W -65/150°C SOD-323; VoltageBreakMin: 7V; VoltageBreakMax: 8,2V; VoltageClamp: 10V; PartNumber: 090201-0003; Value: 5V; VoltageStandoff: 5V; Polarity: BI; Power: 500W; Package: SOD-323; TempRange: -65/150°C; Type: TVS
D?#6 D?#7 = 050101-0002: D# LED Green0,0540mcd @ 20mASML-D12P8WT86C-40/80°C 0603 AEC-Q101; Color: Green; Power: 50mW; PartNumber: 050101-0002; Value: SML-D12P8WT86C; Value2: Green; Features: AEC-Q101; LuminousIntensity: 40mcd @ 20mA; Package: 0603; TempRange: -40/80°C; Type: LED
D?#12-D?#14 = 050101-0002: D# LED Green0,0540mcd @ 20mASML-D12P8WT86C-40/80°C 0603 AEC-Q101; Power: 50mW; PartNumber: 050101-0002; Value: SML-D12P8WT86C; Value2: Green; Features: AEC-Q101; LuminousIntensity: 40mcd @ 20mA; Package: 0603; TempRange: -40/80°C; Type: LED
FI?#1-FI?#5 = 010501-0020: FI# BEAD  1kΩ @  100MHz 25%  1.5A  150mΩdc 0805; TempRange: -55/125°C; PartNumber: 010501-0020; Value: 1kΩ; Frequency: 100MHz; DCValue: 150mΩdc; Current: 1.5A; Tolerance: 25%; Package: 0805; Type: BEAD
FL?#1-FL?#3 = 010502-0035: FL# CM FL  90Ω @  100MHz  370mA  300mΩdc; TempRange: -40/125°C; PartNumber: 010502-0035; Value: 90Ω; Frequency: 100MHz; DCValue: 300mΩdc; Current: 370mA; Type: CM FL
I?#1 = 040903-0001: I# MUX USB FSUSB42MUX MSOP10; TempRange: -40/80°C; PartNumber: 040903-0001; Value: FSUSB42MUX; Package: MSOP10
I?#2 I?#5 = 040703-0001: I# ETH USB2.0 Hub 10/100 ethernet LAN9512 QFN64; TempRange: 0/70°C; PartNumber: 040703-0001; Value: LAN9512; Info: USB2.0 Hub 10/100 ethernet; Package: QFN64
I?#3 = 040308-0001: I# PMIC-SW USB DUAL SWITCH AP2156 MSOP8; TempRange: -40/80°C; PartNumber: 040308-0001; Value: AP2156; Info: USB DUAL SWITCH; Package: MSOP8
I?#4 = 040203-0001: I# EEPROM SPI 2MHz 4kB CAT93C66 TSSOP8; TempRange: -40/85°C; PartNumber: 040203-0001; Value: CAT93C66; Info: SPI 2MHz; Package: TSSOP8
J?#1 = 070503-0003: J# USB Straight Micro Type B Molex 1051330001; PartNumber: 070503-0003; Direction: Straight
J?#2 J?#3 = 070503-0002: J USB Straight Type A TE 1734366-2 / 1734366-2; PartNumber: 070503-0002; Direction: Straight
J?#4 = 070502-0001: J RJ45 13Y/G LedWurth 7499010121A; Info: Y/G Led; Direction: Angled; PartNumber: 070502-0001; Type: RJ45
Q?#1-Q?#3 = 020201-0002: Q# SINGLE N 2N7002P  350mA 60V 350mW SOT23; RdsOn: 1,6Ω; VgsTh: 1,75V; TempRange: -55/150°C; PartNumber: 020201-0002; Value: 2N7002P; Current: 350mA; Vds: 60V; Power: 350mW; Package: SOT23; MosfetType: N; Type: SINGLE
R?#1 R?#2 R?#14 R?#15 R?#22 R?#24 R?#29 R?#31-R?#33 R?#45 R?#46 R?#49 = 010201-0007: R# FIX  27Ω 1% 100mW 0603; Voltage: 50V; TempRange: -55/155°C; PartNumber: 010201-0007; Value: 27Ω; Tolerance: 1%; Power: 100mW; Package: 0603; Type: FIX
R?#3 R?#10 R?#48 = 010201-0038: R# FIX  10kΩ 1% 100mW 0603; Voltage: 50V; TempRange: -55/155°C; PartNumber: 010201-0038; Value: 10kΩ; Tolerance: 1%; Power: 100mW; Package: 0603; Type: FIX
R?#4 R?#6 R?#7 = 010201-0046: R# FIX  47kΩ 1% 100mW 0603; Voltage: 50V; TempRange: -55/155°C; PartNumber: 010201-0046; Value: 47kΩ; Tolerance: 1%; Power: 100mW; Package: 0603; Type: FIX
R?#5 R?#43 R?#51 R?#55 R?#57 = 010201-0001: R# FIX 0Ω 1% 100mW 0603; Voltage: 50V; TempRange: -55/155°C; PartNumber: 010201-0001; Value: 0Ω; Tolerance: 1%; Power: 100mW; Package: 0603; Type: FIX
R?#8 R?#9 R?#16 R?#17 R?#19-R?#21 R?#25 R?#26 R?#34-R?#37 R?#50 = 010201-0062: R# FIX  1MΩ 1% 100mW 0603; Voltage: 50V; TempRange: -55/155°C; PartNumber: 010201-0062; Value: 1MΩ; Tolerance: 1%; Power: 100mW; Package: 0603; Type: FIX
R?#11 = 010201-0050: R# FIX  100kΩ 1% 100mW 0603; Voltage: 50V; TempRange: -55/155°C; PartNumber: 010201-0050; Value: 100kΩ; Tolerance: 1%; Power: 100mW; Package: 0603; Type: FIX
R?#12 = 010201-0039: R# FIX  12kΩ 1% 100mW 0603; TempRange: -55/155°C; PartNumber: 010201-0039; Value: 12kΩ; Tolerance: 1%; Power: 100mW; Package: 0603; Type: FIX
R?#13 R?#27 R?#28 R?#47 = 010201-0026: R# FIX  1kΩ 1% 100mW 0603; Voltage: 50V; TempRange: -55/155°C; PartNumber: 010201-0026; Value: 1kΩ; Tolerance: 1%; Power: 100mW; Package: 0603; Type: FIX
R?#18 R?#23 = 010201-0075: R# FIX 0Ω 1% 125mW 0805; Voltage: 50V; TempRange: -55/155°C; PartNumber: 010201-0075; Value: 0Ω; Tolerance: 1%; Power: 125mW; Package: 0805; Type: FIX
R?#30 R?#52 = 010201-0038: R# FIX  10kΩ 1% 100mW 0603; TempRange: -55/155°C; PartNumber: 010201-0038; Value: 10kΩ; Tolerance: 1%; Power: 100mW; Package: 0603; Type: FIX
R?#38 = 010201-0002: R# FIX  10Ω 1% 100mW 0603; Voltage: 50V; TempRange: -55/155°C; PartNumber: 010201-0002; Value: 10Ω; Tolerance: 1%; Package: 0603; Power: 100mW; Type: FIX
R?#39-R?#42 = 010201-0224: R# FIX  49.9Ω 1% 100mW 0603; Voltage: 50V; TempRange: -55/155°C; PartNumber: 010201-0224; Value: 49.9Ω; Tolerance: 1%; Package: 0603; Power: 100mW; Type: FIX
R?#44 R?#54 R?#60-R?#62 = 010201-0020: R# FIX  330Ω 1% 100mW 0603; Voltage: 50V; TempRange: -55/155°C; PartNumber: 010201-0020; Value: 330Ω; Tolerance: 1%; Package: 0603; Power: 100mW; Type: FIX
R?#53 = 010201-0223: R# FIX  12.4kΩ 1% 100mW 0603; Voltage: 50V; TempRange: -55/155°C; PartNumber: 010201-0223; Value: 12.4kΩ; Tolerance: 1%; Package: 0603; Power: 100mW; Type: FIX
R?#56 = 010201-0074: R# FIX  10MΩ 1% 100mW 0603; Voltage: 50V; TempRange: -55/155°C; PartNumber: 010201-0074; Value: 10MΩ; Tolerance: 1%; Package: 0603; Power: 100mW; Type: FIX
R?#58 R?#59 = 010201-0206: R# FIX  470kΩ 1% 250mW 1206; Voltage: 50V; TempRange: -55/155°C; PartNumber: 010201-0206; Value: 470kΩ; Tolerance: 1%; Package: 1206; Power: 250mW; Type: FIX
X?#1 = 010401-0002: X# XTAL  25MHz 30ppm 5x3.2mm -40/85°C; LoadCapacitance: 20pF; ShuntCapacitance: 7pF; EqSeriesResistance: 50; StabilityAge: 5ppm; DriveLevel: 500uW; PartNumber: 010401-0002; Tolerance: 30ppm; Dimension: 5x3.2mm; TempRange: -40/85°C; Type: XTAL; StabilityTemp: 30ppm

## Sheet LAN-PWR.SchDoc
size A2
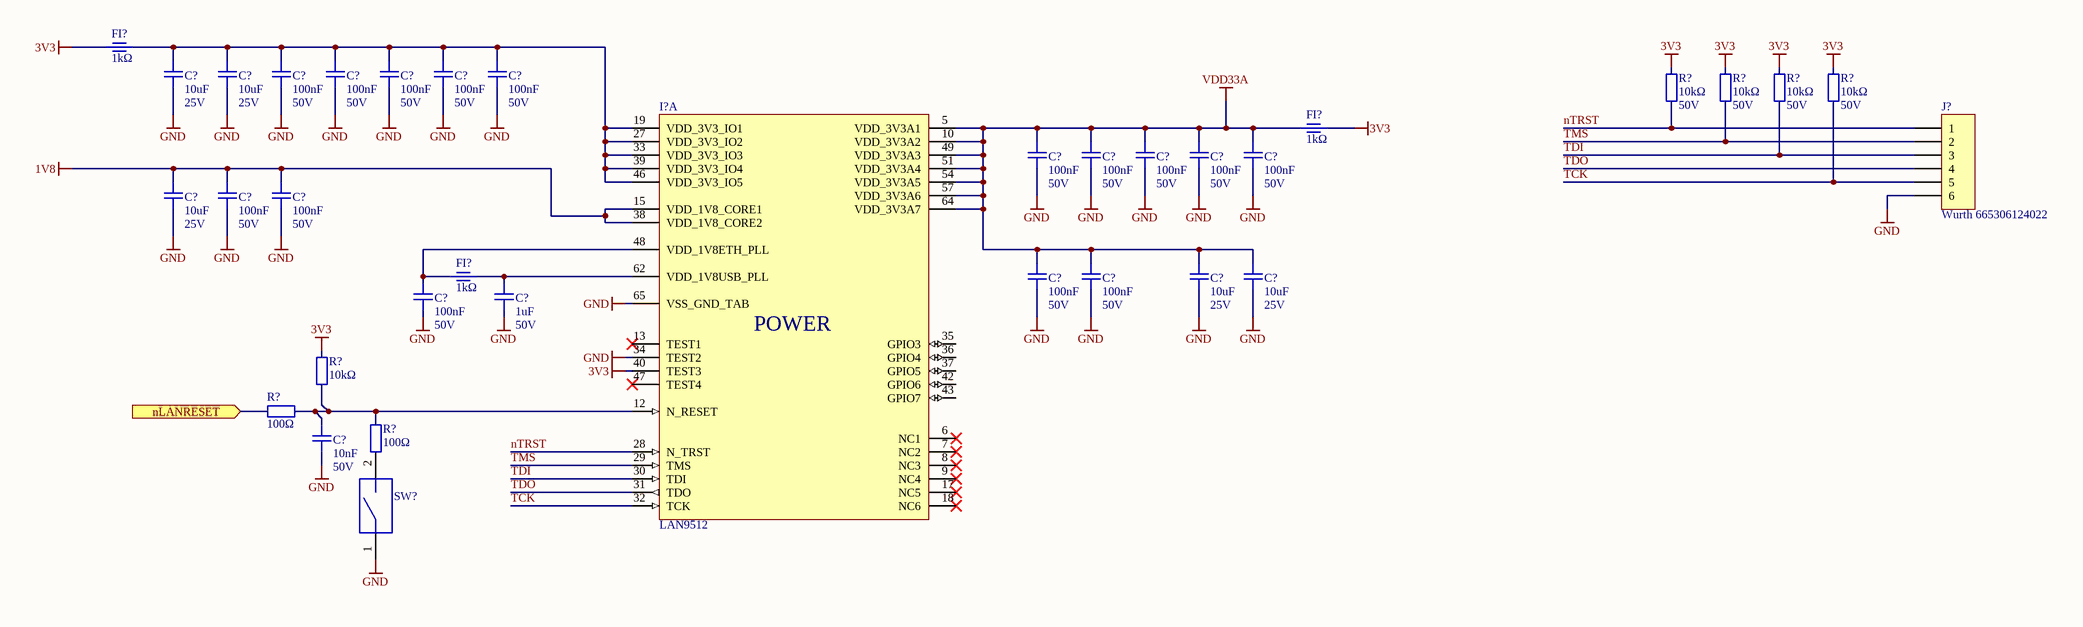
[diagram p4: LAN-PWR.SchDoc]

### Parts
(Parts that share a designator on the sheet are numbered #1, #2 ... from top to bottom, then left to right.)
C?#48  Voltage: 25V  [C0603M_1709282117]  (hidden comment: 10uF)
C?#49  Voltage: 25V  [C0603M_1709282117]  (hidden comment: 10uF)
C?#50  Voltage: 50V  [C0603M_1709282117]  (hidden comment: 100nF)
C?#51  Voltage: 50V  [C0603M_1709282117]  (hidden comment: 100nF)
C?#52  Voltage: 50V  [C0603M_1709282117]  (hidden comment: 100nF)
C?#53  Voltage: 50V  [C0603M_1709282117]  (hidden comment: 100nF)
C?#54  Voltage: 50V  [C0603M_1709282117]  (hidden comment: 100nF)
C?#55  Voltage: 50V  [C0603M_1709282117]  (hidden comment: 100nF)
C?#56  Voltage: 50V  [C0603M_1709282117]  (hidden comment: 100nF)
C?#57  Voltage: 50V  [C0603M_1709282117]  (hidden comment: 100nF)
C?#58  Voltage: 50V  [C0603M_1709282117]  (hidden comment: 100nF)
C?#59  Voltage: 50V  [C0603M_1709282117]  (hidden comment: 100nF)
C?#60  Voltage: 25V  [C0603M_1709282117]  (hidden comment: 10uF)
C?#61  Voltage: 50V  [C0603M_1709282117]  (hidden comment: 100nF)
C?#62  Voltage: 50V  [C0603M_1709282117]  (hidden comment: 100nF)
C?#63  Voltage: 50V  [C0603M_1709282117]  (hidden comment: 100nF)
C?#64  Voltage: 50V  [C0603M_1709282117]  (hidden comment: 100nF)
C?#65  Voltage: 25V  [C0603M_1709282117]  (hidden comment: 10uF)
C?#66  Voltage: 25V  [C0603M_1709282117]  (hidden comment: 10uF)
C?#67  Voltage: 50V  [C0603M_1709282117]  (hidden comment: 100nF)
C?#68  Voltage: 50V  [C0603M_1709282117]  (hidden comment: 1uF)
C?#69  Voltage: 50V  [C0603M_1709282117]  (hidden comment: 10nF)
FI?#6  1kΩ  [L0805M_1708232324]
FI?#7  1kΩ  [L0805M_1708232324]
FI?#8  1kΩ  [L0805M_1708232324]
I?#6  LAN9512  [QFN64_1706282152]  (part A of 3)
J?#5  Article: Wurth 665306124022  [WTB_WURTH_665306124022_1709042341]  (hidden comment: connector_6p_1709042336)
R?#63  Voltage: 50V  [R0603M_RESC1608X06N]  (hidden comment: 10kΩ)
R?#64  Voltage: 50V  [R0603M_RESC1608X06N]  (hidden comment: 10kΩ)
R?#65  Voltage: 50V  [R0603M_RESC1608X06N]  (hidden comment: 10kΩ)
R?#66  Voltage: 50V  [R0603M_RESC1608X06N]  (hidden comment: 10kΩ)
R?#67  10kΩ  [R0603M_RESC1608X06N]
R?#68  100Ω  [R0603M_RESC1608X06N]
R?#69  100Ω  [R0603M_RESC1608X06N]
SW?#1  (no value)  [TACT_2.5x3_OMRON_B3U-1000P]

### Ports
nLANRESET (in)

### Nets
1V8: C?#60.2 C?#61.2 C?#62.2 I?#6.15(VDD_1V8_CORE1) I?#6.38(VDD_1V8_CORE2)
3V3: FI?#6.1 FI?#7.2 I?#6.40(TEST3) R?#63.2 R?#64.2 R?#65.2 R?#66.2 R?#67.2
GND: C?#48.1 C?#49.1 C?#50.1 C?#51.1 C?#52.1 C?#53.1 C?#54.1 C?#55.1 C?#56.1 C?#57.1 C?#58.1 C?#59.1 C?#60.1 C?#61.1 C?#62.1 C?#63.1 C?#64.1 C?#65.1 C?#66.1 C?#67.1 C?#68.1 C?#69.1 I?#6.34(TEST2) I?#6.65(VSS_GND_TAB) J?#5.6 SW?#1.1
VDD33A: C?#55.2 C?#56.2 C?#57.2 C?#58.2 C?#59.2 C?#63.2 C?#64.2 C?#65.2 C?#66.2 FI?#7.1 I?#6.5(VDD_3V3A1) I?#6.10(VDD_3V3A2) I?#6.49(VDD_3V3A3) I?#6.51(VDD_3V3A4) I?#6.54(VDD_3V3A5) I?#6.57(VDD_3V3A6) I?#6.64(VDD_3V3A7)
nTRST: I?#6.28(N_TRST) J?#5.1 R?#63.1
TCK: I?#6.32(TCK) J?#5.5 R?#66.1
TDI: I?#6.30(TDI) J?#5.3 R?#65.1
TDO: I?#6.31(TDO) J?#5.4
TMS: I?#6.29(TMS) J?#5.2 R?#64.1
NetA?#1_3: R?#68.1 ; port nLANRESET
NetC?#48_2: C?#48.2 C?#49.2 C?#50.2 C?#51.2 C?#52.2 C?#53.2 C?#54.2 FI?#6.2 I?#6.19(VDD_3V3_IO1) I?#6.27(VDD_3V3_IO2) I?#6.33(VDD_3V3_IO3) I?#6.39(VDD_3V3_IO4) I?#6.46(VDD_3V3_IO5)
NetC?#67_2: C?#67.2 FI?#8.1 I?#6.48(VDD_1V8ETH_PLL)
NetC?#68_2: C?#68.2 FI?#8.2 I?#6.62(VDD_1V8USB_PLL)
NetC?#69_2: C?#69.2 I?#6.12(N_RESET) R?#67.1 R?#68.2 R?#69.2
NetR?#69_1: R?#69.1 SW?#1.2

Not connected (* = marked no-connect by the designer): I?#6 6(NC1)* 7(NC2)* 8(NC3)* 9(NC4)* 13(TEST1)* 17(NC5)* 18(NC6)* 35(GPIO3) 36(GPIO4) 37(GPIO5) 42(GPIO6) 43(GPIO7) 47(TEST4)*

### Notes on the sheet
- Title
- Size:
- Date:
- A3
- Number:
- Time:
- Revision:
- Sheet
- of
- File:
- (in symbol 040703-0001, part A) POWER

### Library data of the parts
C?#48 C?#49 C?#60 C?#65 C?#66 = 010103-0083: as C?#1 on sheet LAN; PartNumber: 010103-0083; Value: 10uF; Tolerance: 20%; Package: 0603; Dielectric: X5R; Type: CER
C?#50-C?#59 C?#61-C?#64 C?#67 = 010103-0061: as C?#2 on sheet LAN; PartNumber: 010103-0061; Value: 100nF; Tolerance: 10%; Package: 0603; Dielectric: X7R; Type: CER
C?#68 = 010103-0073: C# CER  1uF 10% 50V X7R 0603; TempRange: -55/125°C; PartNumber: 010103-0073; Value: 1uF; Tolerance: 10%; Package: 0603; Dielectric: X7R; Type: CER
C?#69 = 010103-0049: C# CER  10nF 10% 50V X7R 0603; TempRange: -55/125°C; PartNumber: 010103-0049; Value: 10nF; Tolerance: 10%; Package: 0603; Dielectric: X7R; Type: CER
FI?#6-FI?#8 = 010501-0020: as FI?#1 on sheet LAN; PartNumber: 010501-0020; Value: 1kΩ; Frequency: 100MHz; DCValue: 150mΩdc; Current: 1.5A; Tolerance: 25%; Package: 0805; Type: BEAD
I?#6 = 040703-0001: as I?#2 on sheet LAN; PartNumber: 040703-0001; Value: LAN9512; Info: USB2.0 Hub 10/100 ethernet; Package: QFN64
J?#5 = 070101-0001: J# WTB 6p Male Straight Wurth 665306124022; PartNumber: 070101-0001; Gender: Male; Direction: Straight
R?#63-R?#66 = 010201-0038: as R?#30 on sheet LAN; PartNumber: 010201-0038; Value: 10kΩ; Tolerance: 1%; Power: 100mW; Package: 0603; Type: FIX
R?#67 = 010201-0038: as R?#3 on sheet LAN; PartNumber: 010201-0038; Value: 10kΩ; Tolerance: 1%; Power: 100mW; Package: 0603; Type: FIX
R?#68 R?#69 = 010201-0014: R# FIX  100Ω 1% 100mW 0603; Voltage: 50V; TempRange: -55/155°C; PartNumber: 010201-0014; Value: 100Ω; Tolerance: 1%; Power: 100mW; Package: 0603; Type: FIX
SW?#1 = 080103-0003: S# PUSH 50mA 12Vdc Omron B3U-1000P; PartNumber: 080103-0003; ContactVoltageDC: 12Vdc; ContactCurrent: 50mA

## Sheet CAN.SchDoc
size A2
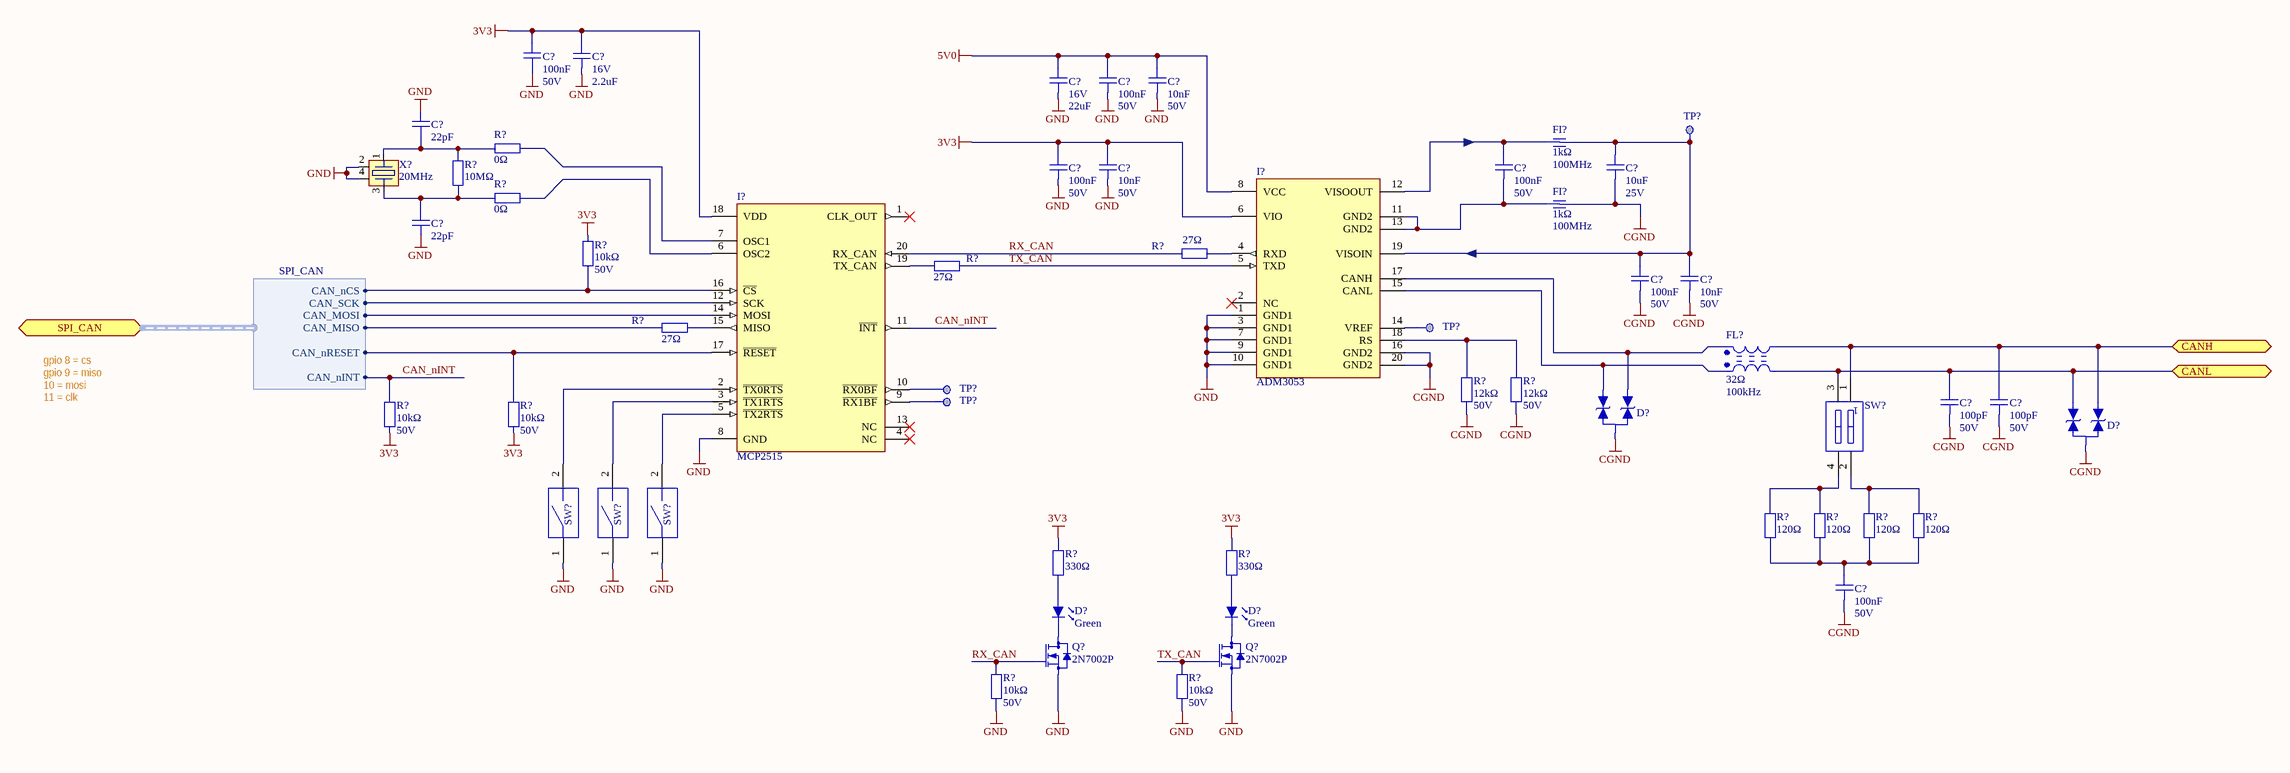
[diagram p5: CAN.SchDoc]

### Parts
(Parts that share a designator on the sheet are numbered #1, #2 ... from top to bottom, then left to right.)
C?#70  Voltage: 50V  [C0603M_1709282117]  (hidden comment: 100nF)
C?#71  Value2: 16V  [C0603M_1709282117]  (hidden comment: 2.2uF)
C?#72  Value2: 16V  [C0805M_1708282121]  (hidden comment: 22uF)
C?#73  Voltage: 50V  [C0603M_1709282117]  (hidden comment: 100nF)
C?#74  Voltage: 50V  [C0603M_1709282117]  (hidden comment: 10nF)
C?#75  22pF  [C0603M_1709282117]
C?#76  Voltage: 50V  [C0603M_1709282117]  (hidden comment: 100nF)
C?#77  Voltage: 50V  [C0603M_1709282117]  (hidden comment: 10nF)
C?#78  Voltage: 50V  [C0603M_1709282117]  (hidden comment: 100nF)
C?#79  Voltage: 25V  [C0603M_1709282117]  (hidden comment: 10uF)
C?#80  22pF  [C0603M_1709282117]
C?#81  Voltage: 50V  [C0603M_1709282117]  (hidden comment: 100nF)
C?#82  Voltage: 50V  [C0603M_1709282117]  (hidden comment: 10nF)
C?#83  Voltage: 50V  [C0603M_1709282117]  (hidden comment: 100pF)
C?#84  Voltage: 50V  [C0603M_1709282117]  (hidden comment: 100pF)
C?#85  Voltage: 50V  [C0603M_1709282117]  (hidden comment: 100nF)
D?#15  (no value)
D?#16  (no value)
D?#17  Color: Green  [LED_SML-D12x8_1709122228]  (hidden comment: SML-D12P8WT86C)
D?#18  Color: Green  [LED_SML-D12x8_1709122228]  (hidden comment: SML-D12P8WT86C)
FI?#9  Frequency: 100MHz  [L1206M_1708232326]  (hidden comment: 1kΩ)
FI?#10  Frequency: 100MHz  [L1206M_1708232326]  (hidden comment: 1kΩ)
FL?#4  Frequency: 100kHz  [CMDR331M_1709290000]  (hidden comment: 32Ω)
I?#7  ADM3053  [SO20_W_1709182243]
I?#8  MCP2515  [QFN20_1706282325]
Q?#4  2N7002P  [SOT23_1709070018]
Q?#5  2N7002P  [SOT23_1709070018]
R?#70  0Ω  [R0603M_RESC1608X06N]
R?#71  10MΩ  [R0603M_RESC1608X06N]
R?#72  0Ω  [R0603M_RESC1608X06N]
R?#73  Voltage: 50V  [R0603M_RESC1608X06N]  (hidden comment: 10kΩ)
R?#74  27Ω  [R0603M_RESC1608X06N]
R?#75  27Ω  [R0603M_RESC1608X06N]
R?#76  27Ω  [R0603M_RESC1608X06N]
R?#77  Voltage: 50V  [R0603M_RESC1608X06N]  (hidden comment: 12kΩ)
R?#78  Voltage: 50V  [R0603M_RESC1608X06N]  (hidden comment: 12kΩ)
R?#79  Voltage: 50V  [R0603M_RESC1608X06N]  (hidden comment: 10kΩ)
R?#80  Voltage: 50V  [R0603M_RESC1608X06N]  (hidden comment: 10kΩ)
R?#81  120Ω  [R0805M_RESC2012X06N]
R?#82  120Ω  [R0805M_RESC2012X06N]
R?#83  120Ω  [R0805M_RESC2012X06N]
R?#84  120Ω  [R0805M_RESC2012X06N]
R?#85  330Ω  [R0603M_RESC1608X06N]
R?#86  330Ω  [R0603M_RESC1608X06N]
R?#87  Voltage: 50V  [R0603M_RESC1608X06N]  (hidden comment: 10kΩ)
R?#88  Voltage: 50V  [R0603M_RESC1608X06N]  (hidden comment: 10kΩ)
SW?#2  (no value)  [DIP1_OMORN_A6S-2104-H_1709272345]
SW?#3  (no value)  [TACT_2.5x3_OMRON_B3U-1000P]
SW?#4  (no value)  [TACT_2.5x3_OMRON_B3U-1000P]
SW?#5  (no value)  [TACT_2.5x3_OMRON_B3U-1000P]
TP?#1  (no value)  [TESTPAD_1MM_ROUND]
TP?#2  (no value)  [TESTPAD_1MM_ROUND]
TP?#3  (no value)  [TESTPAD_1MM_ROUND]
TP?#4  (no value)  [TESTPAD_1MM_ROUND]
X?#2  Frequency: 20MHz  [crystal_4p_5x3.2_1709260017]

### Ports
CANH, CANL, SPI_CAN (harness SPI_CAN)

### Harnesses
SPI_CAN: CAN_nCS, CAN_SCK, CAN_MOSI, CAN_MISO, CAN_nRESET, CAN_nINT

### Nets
3V3: C?#70.1 C?#71.2 C?#76.2 C?#77.2 I?#7.6(VIO) I?#8.18(VDD) R?#73.2 R?#79.2 R?#80.2 R?#85.1 R?#86.1
5V0: C?#72.2 C?#73.2 C?#74.2 I?#7.8(VCC)
CGND: C?#79.1 C?#81.1 C?#82.1 C?#83.1 C?#84.1 C?#85.1 D?#15.3 D?#16.3 FI?#10.2 I?#7.16(GND2) I?#7.20(GND2) R?#77.1 R?#78.1
GND: C?#70.2 C?#71.1 C?#72.1 C?#73.1 C?#74.1 C?#75.2 C?#76.1 C?#77.1 C?#80.1 I?#7.1(GND1) I?#7.3(GND1) I?#7.7(GND1) I?#7.9(GND1) I?#7.10(GND1) I?#8.8(GND) Q?#4.3(D) Q?#5.3(D) R?#87.1 R?#88.1 SW?#3.1 SW?#4.1 SW?#5.1 X?#2.2 X?#2.4
CAN_nINT: I?#8.11(~{INT}) R?#79.1 ; port SPI_CAN.CAN_nINT
RX_CAN: I?#8.20(RX_CAN) Q?#4.1(G) R?#74.1 R?#87.2
TX_CAN: I?#7.5(TXD) Q?#5.1(G) R?#75.2 R?#88.2
NetC?#75_1: C?#75.1 R?#70.1 R?#71.2 X?#2.1
NetC?#78_1: C?#78.1 FI?#10.1 I?#7.11(GND2) I?#7.13(GND2)
NetC?#78_2: C?#78.2 FI?#9.1 I?#7.12(VISOOUT)
NetC?#79_2: C?#79.2 C?#81.2 C?#82.2 FI?#9.2 I?#7.19(VISOIN) TP?#1.1
NetC?#80_2: C?#80.2 R?#71.1 R?#72.1 X?#2.3
NetC?#83_2: C?#83.2 D?#16.2 FL?#4.3 SW?#2.3 ; port CANL
NetC?#84_2: C?#84.2 D?#16.1 FL?#4.4 SW?#2.1 ; port CANH
NetC?#85_2: C?#85.2 R?#81.1 R?#82.1 R?#83.1 R?#84.1
NetD?#15_1: D?#15.1 FL?#4.1 I?#7.17(CANH)
NetD?#15_2: D?#15.2 FL?#4.2 I?#7.15(CANL)
NetD?#17_1: D?#17.1(Cathode) Q?#4.2(S)
NetD?#17_2: D?#17.2(Anode) R?#85.2
NetD?#18_1: D?#18.1(Cathode) Q?#5.2(S)
NetD?#18_2: D?#18.2(Anode) R?#86.2
NetI?#7_4: I?#7.4(RXD) R?#74.2
NetI?#7_14: I?#7.14(VREF) TP?#2.1
NetI?#7_18: I?#7.18(RS) R?#77.2 R?#78.2
NetI?#8_2: I?#8.2(~{TX0RTS}) SW?#3.2
NetI?#8_3: I?#8.3(~{TX1RTS}) SW?#4.2
NetI?#8_5: I?#8.5(~{TX2RTS}) SW?#5.2
NetI?#8_6: I?#8.6(OSC2) R?#72.2
NetI?#8_7: I?#8.7(OSC1) R?#70.2
NetI?#8_9: I?#8.9(~{RX1BF}) TP?#4.1
NetI?#8_10: I?#8.10(~{RX0BF}) TP?#3.1
NetI?#8_12: I?#8.12(SCK) ; port SPI_CAN.CAN_SCK
NetI?#8_14: I?#8.14(MOSI) ; port SPI_CAN.CAN_MOSI
NetI?#8_15: I?#8.15(MISO) R?#76.2
NetI?#8_16: I?#8.16(~{CS}) R?#73.1 ; port SPI_CAN.CAN_nCS
NetI?#8_17: I?#8.17(~{RESET}) R?#80.1 ; port SPI_CAN.CAN_nRESET
NetI?#8_19: I?#8.19(TX_CAN) R?#75.1
NetR?#76_1: R?#76.1 ; port SPI_CAN.CAN_MISO
NetR?#81_2: R?#81.2 R?#82.2 SW?#2.4
NetR?#83_2: R?#83.2 R?#84.2 SW?#2.2

Not connected (* = marked no-connect by the designer): I?#7 2(NC)*; I?#8 1(CLK_OUT)* 4(NC)* 13(NC)*

### Notes on the sheet
- gpio 8 = cs
  gpio 9 = miso
  10 = mosi
  11 = clk
- Title
- Size:
- Date:
- A3
- Number:
- Time:
- Revision:
- Sheet
- of
- File:

### Library data of the parts
C?#70 C?#73 C?#76 C?#78 C?#81 C?#85 = 010103-0061: as C?#2 on sheet LAN; PartNumber: 010103-0061; Value: 100nF; Tolerance: 10%; Package: 0603; Dielectric: X7R; Type: CER
C?#71 = 010103-0074: as C?#5 on sheet LAN; PartNumber: 010103-0074; Value: 2.2uF; Voltage: 16V; Tolerance: 20%; Package: 0603; Dielectric: X7R; Type: CER
C?#72 = 010103-0102: as C?#11 on sheet LAN; PartNumber: 010103-0102; Value: 22uF; Voltage: 16V; Tolerance: 10%; Package: 0805; Dielectric: X5R; Type: CER
C?#74 C?#77 C?#82 = 010103-0049: as C?#69 on sheet LAN-PWR; PartNumber: 010103-0049; Value: 10nF; Tolerance: 10%; Package: 0603; Dielectric: X7R; Type: CER
C?#75 C?#80 = 010103-0129: as C?#40 on sheet LAN; PartNumber: 010103-0129; Value: 22pF; Voltage: 50V; Tolerance: 5%; Package: 0603; Dielectric: NP0; Type: CER
C?#79 = 010103-0083: as C?#1 on sheet LAN; PartNumber: 010103-0083; Value: 10uF; Tolerance: 20%; Package: 0603; Dielectric: X5R; Type: CER
C?#83 C?#84 = 010103-0139: C# CER  100pF 5% 50V NP0 0603; TempRange: -55/125°C; PartNumber: 010103-0139; Value: 100pF; Tolerance: 5%; Package: 0603; Dielectric: NP0; Type: CER
D?#15 D?#16 = tvs_can: =Description
D?#17 D?#18 = 050101-0002: as D?#12 on sheet LAN; PartNumber: 050101-0002; Value: SML-D12P8WT86C; Value2: Green; Features: AEC-Q101; LuminousIntensity: 40mcd @ 20mA; Package: 0603; TempRange: -40/80°C; Type: LED
FI?#9 FI?#10 = 010501-0029: FI# BEAD  1kΩ @  100MHz 25%  1A  300mΩdc 1206; TempRange: -55/125°C; PartNumber: 010501-0029; Value: 1kΩ; Value2: 100MHz; DCValue: 300mΩdc; Current: 1A; Tolerance: 25%; Package: 1206; Type: BEAD
FL?#4 = 010502-0036: FL# CM FL  32Ω @  100kHz 25%  500mA  300mΩdc; TempRange: -40/135°C; PartNumber: 010502-0036; Value: 32Ω; Value2: 100kHz; DCValue: 300mΩdc; Current: 500mA; Tolerance: 25%; Type: CM FL
I?#7 = 040701-0003: I# CAN Isolated with DCDCADM3053SO20-W; TempRange: -40/85°C; PartNumber: 040701-0003; Value: ADM3053; Info: Isolated with DCDC; Package: SO20-W
I?#8 = 040701-0002: I# CAN CAN2.0B controllerMCP2515QFN20; TempRange: -40/85°C; PartNumber: 040701-0002; Value: MCP2515; Info: CAN2.0B controller; Package: QFN20
Q?#4 Q?#5 = 020201-0002: Q# SINGLE 12N7002P  350mA 60V 350mW SOT23; Rdson: 1,6Ω; VgsTh: 1,75V; TempRange: -55/150°C; MosfetType: N; PartNumber: 020201-0002; Value: 2N7002P; Current: 350mA; Vds: 60V; Power: 350mW; Package: SOT23; Type: SINGLE
R?#70 R?#72 = 010201-0001: as R?#5 on sheet LAN; PartNumber: 010201-0001; Value: 0Ω; Tolerance: 1%; Package: 0603; Power: 100mW; Type: FIX
R?#71 = 010201-0074: as R?#56 on sheet LAN; PartNumber: 010201-0074; Value: 10MΩ; Tolerance: 1%; Package: 0603; Power: 100mW; Type: FIX
R?#73 R?#79 R?#80 R?#87 R?#88 = 010201-0038: as R?#30 on sheet LAN; PartNumber: 010201-0038; Value: 10kΩ; Tolerance: 1%; Power: 100mW; Package: 0603; Type: FIX
R?#74-R?#76 = 010201-0007: as R?#1 on sheet LAN; PartNumber: 010201-0007; Value: 27Ω; Tolerance: 1%; Package: 0603; Power: 100mW; Type: FIX
R?#77 R?#78 = 010201-0039: as R?#12 on sheet LAN; PartNumber: 010201-0039; Value: 12kΩ; Tolerance: 1%; Power: 100mW; Package: 0603; Type: FIX
R?#81-R?#84 = 010201-0089: R# FIX  120Ω 1% 125mW 0805; Voltage: 50V; TempRange: -55/155°C; PartNumber: 010201-0089; Value: 120Ω; Tolerance: 1%; Package: 0805; Power: 125mW; Type: FIX
R?#85 R?#86 = 010201-0020: as R?#44 on sheet LAN; PartNumber: 010201-0020; Value: 330Ω; Tolerance: 1%; Package: 0603; Power: 100mW; Type: FIX
SW?#2 = 080101-0004: S# DIP 20,0224Omron A6S-2104-H; ContactVoltageDC: 24Vdc; ContactCurrent: 20mA; Poles: 2p; PartNumber: 080101-0004; Article: Omron A6S-2104-H; Type: DIP
SW?#3-SW?#5 = 080103-0003: S# PUSH 50mA 12Vdc Omron B3U-1000P; PartNumber: 080103-0003; ContactVoltageDC: 12Vdc; ContactCurrent: 50mA
TP?#1-TP?#4 = 100101-0001: TP# TEST PAD ROUND 1mm; PartNumber: 100101-0001; Info: PAD ROUND 1mm
X?#2 = 010401-0003: X# XTAL  20MHz 50ppm 5x3.2mm -10/60°C; LoadCapacitance: 18pF; ShuntCapacitance: 7pF; EqSeriesResistance: 50; StabilityAge: 5ppm; DriveLevel: 10uW; PartNumber: 010401-0003; Tolerance: 50ppm; Dimension: 5x3.2mm; TempRange: -10/60°C; Type: XTAL; StabilityTemp: 50ppm

## Nets that join several sheets
3V3: LAN (22 pins), LAN-PWR (8 pins), CAN (11 pins)
5V0: LAN (C?#17.2 FI?#3.1), CAN (C?#72.2 C?#73.2 C?#74.2 I?#7.8)
GND: RPI-CM3 (61 pins), LAN (91 pins), LAN-PWR (26 pins), CAN (24 pins)
NetA?#1_3: RPI-CM3 (A?#1.3), LAN-PWR (R?#68.1)